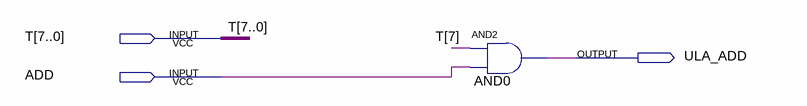
[diagram p0: schematic sheet]
// Quartus schematic ULA_ADD.bdf as structural Verilog: 1 symbols, 3 pins
module ULA_ADD (
  input  [7:0] T,
  input  ADD,
  output ULA_ADD
);

  and AND0 (ULA_ADD, T[7], ADD);
endmodule
